# EAGLE schematic v1 (EAGLE 7.1.0)
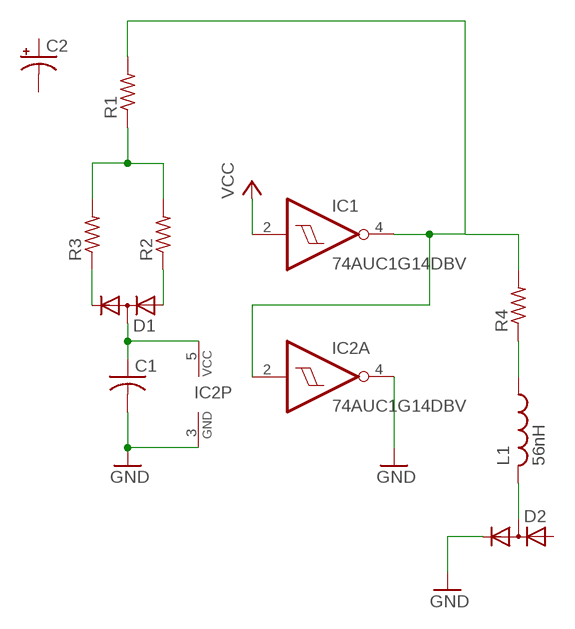
[diagram p0: schematic, sheet 1]

## Parts
C1  C-USC0402  [C0402]
C2  CPOL-USB  [PANASONIC_B]
D1  DIODE_2CACA-SOT23  [SOT23]
D2  DIODE_2CACA-SOT23  [SOT23]
IC1  74AUC1G14DBV  [SOT23-5]
IC2  74AUC1G14DBV  [SOT23-5]
L1  56nH  L-USL2012C  [L2012C]
R1  R-US_R0805  [R0805]
R2  R-US_R0805  [R0805]
R3  R-US_R0805  [R0805]
R4  R-US_R0805  [R0805]

## Nets
GND: C1.2 D2.2(C) IC2.3 IC2.4(A:O)
N$1: D1.1(A) R2.1
N$2: D1.2(C) R3.1
N$3: IC1.4(O) IC2.2(A:I) R1.2 R4.2
N$4: L1.1 R4.1
N$5: R1.1 R2.2 R3.2
N$6: C1.1 D1.3(AC) IC2.5
N$7: D2.3(AC) L1.2
VCC: IC1.2(I)
Unconnected: C2.+ C2.- D2.1(A)

## Power pins joined to a net without a drawn wire
GND: IC1.3(GND)
VCC: IC1.5(VCC)

## Library data of the parts
C1 = rcl:C-US: CAPACITOR, American symbol
C2 = rcl:CPOL-US: POLARIZED CAPACITOR, American symbol
D1 D2 = diode:DIODE_2CACA-: 2 Diodes - Cathode-Anode|Cathode-Anode
IC1 = 74xx-little-us:74*1G14: Single Schmitt-Trigger Inverter Gate
IC2 = 74xx-little-us-edited:74*1G14: Single Schmitt-Trigger Inverter Gate
L1 = rcl:L-US: INDUCTOR, American symbol
R1-R4 = rcl:R-US_: RESISTOR, American symbol